# Altium schematic sheet TUSB8041_Connectors_2.SchDoc
size A3; SheetNumber: 1; SheetTotal: 3
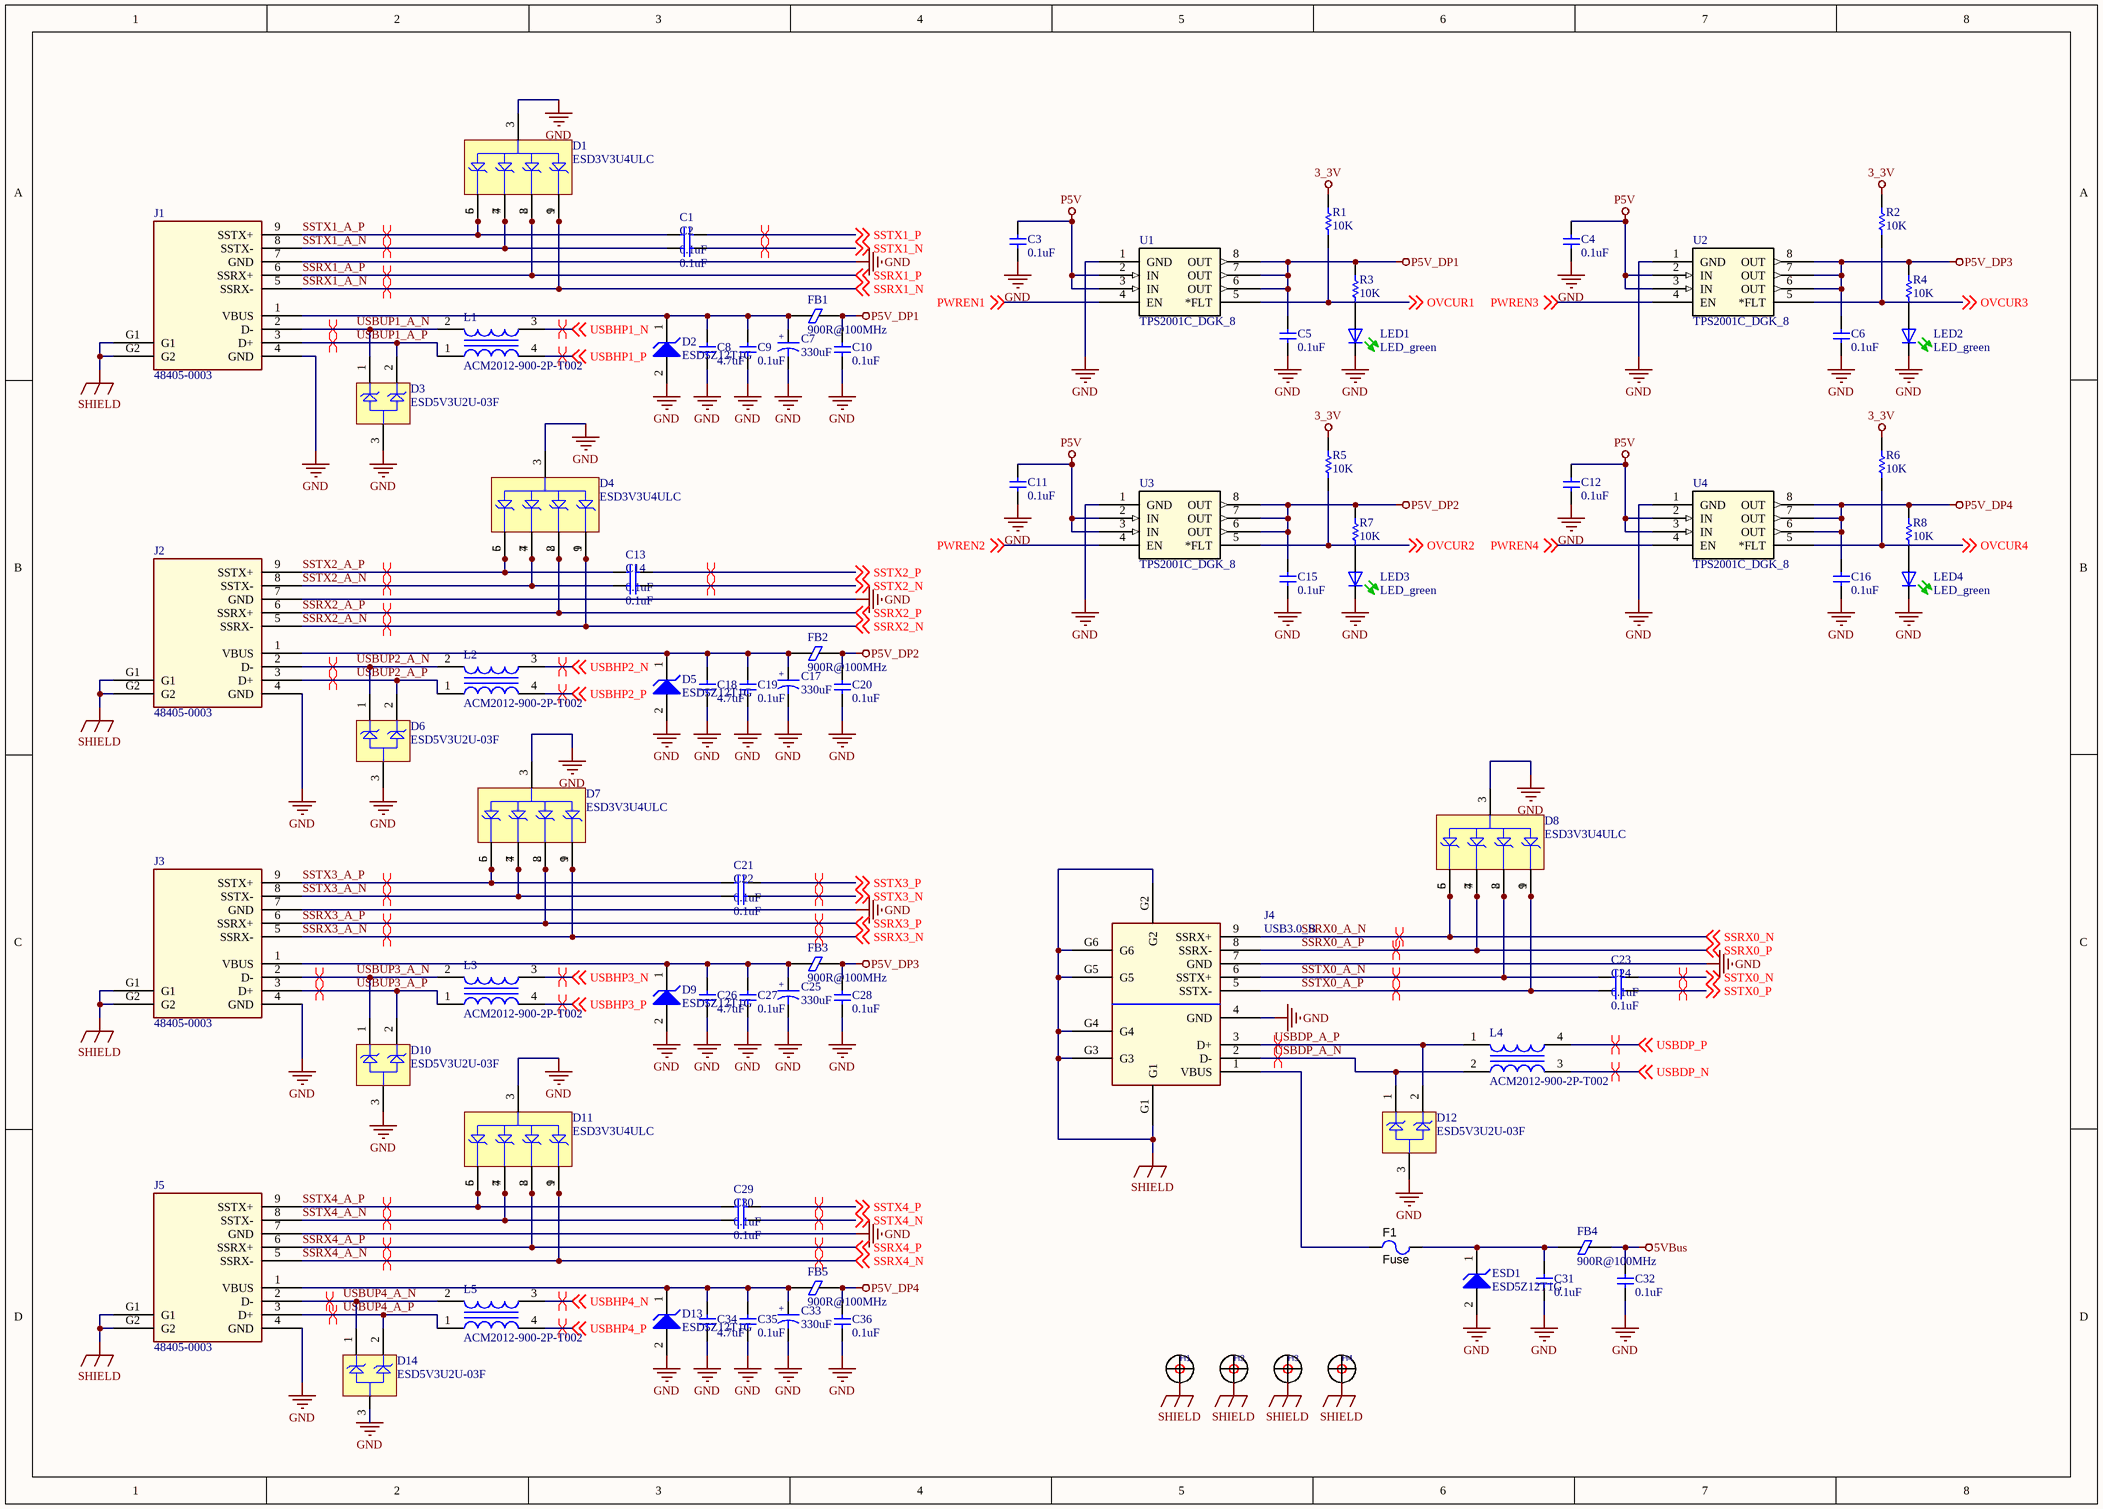
[diagram p0: TUSB8041_Connectors_2.SchDoc]

## Parts
C1  0.1uF  [CAP0402]
C2  0.1uF  [CAP0402]
C3  0.1uF  [CAP0603]
C4  0.1uF  [CAP0603]
C5  0.1uF  [CAP0603]
C6  0.1uF  [CAP0603]
C7  330uF  [CAP7343_TANT]
C8  4.7uF  [CAP0603]
C9  0.1uF  [CAP0603]
C10  0.1uF  [CAP0603]
C11  0.1uF  [CAP0603]
C12  0.1uF  [CAP0603]
C13  0.1uF  [CAP0402]
C14  0.1uF  [CAP0402]
C15  0.1uF  [CAP0603]
C16  0.1uF  [CAP0603]
C17  330uF  [CAP7343_TANT]
C18  4.7uF  [CAP0603]
C19  0.1uF  [CAP0603]
C20  0.1uF  [CAP0603]
C21  0.1uF  [CAP0402]
C22  0.1uF  [CAP0402]
C23  0.1uF  [CAP0402]
C24  0.1uF  [CAP0402]
C25  330uF  [CAP7343_TANT]
C26  4.7uF  [CAP0603]
C27  0.1uF  [CAP0603]
C28  0.1uF  [CAP0603]
C29  0.1uF  [CAP0402]
C30  0.1uF  [CAP0402]
C31  0.1uF  [CAP0603]
C32  0.1uF  [CAP0603]
C33  330uF  [CAP7343_TANT]
C34  4.7uF  [CAP0603]
C35  0.1uF  [CAP0603]
C36  0.1uF  [CAP0603]
D1  ESD3V3U4ULC  [PG-TSLP-9-1]
D2  ESD5Z12T1G  [ONSC-SOD-523-2-502-01_V]
D3  ESD5V3U2U-03F  [INF-PG-TSFP-3-1_V]
D4  ESD3V3U4ULC  [PG-TSLP-9-1]
D5  ESD5Z12T1G  [ONSC-SOD-523-2-502-01_V]
D6  ESD5V3U2U-03F  [INF-PG-TSFP-3-1_V]
D7  ESD3V3U4ULC  [PG-TSLP-9-1]
D8  ESD3V3U4ULC  [PG-TSLP-9-1]
D9  ESD5Z12T1G  [ONSC-SOD-523-2-502-01_V]
D10  ESD5V3U2U-03F  [INF-PG-TSFP-3-1_V]
D11  ESD3V3U4ULC  [PG-TSLP-9-1]
D12  ESD5V3U2U-03F  [INF-PG-TSFP-3-1_V]
D13  ESD5Z12T1G  [ONSC-SOD-523-2-502-01_V]
D14  ESD5V3U2U-03F  [INF-PG-TSFP-3-1_V]
ESD1  ESD5Z12T1G  [ONSC-SOD-523-2-502-01_V]
F1  Fuse  [FUSE1206]
FB1  900R@100MHz  [L0805]
FB2  900R@100MHz  [L0805]
FB3  900R@100MHz  [L0805]
FB4  900R@100MHz  [L0805]
FB5  900R@100MHz  [L0805]
H1  HOLE  [HOLE_Φ3_1_2D]  (value not drawn)
H2  HOLE  [HOLE_Φ3_1_2D]  (value not drawn)
H3  HOLE  [HOLE_Φ3_1_2D]  (value not drawn)
H4  HOLE  [HOLE_Φ3_1_2D]  (value not drawn)
J1  48405-0003  [CN_USB30_A]
J2  48405-0003  [CN_USB30_A]
J3  48405-0003  [CN_USB30_A]
J4  USB3.0_B  [ASS_4224_CO]
J5  48405-0003  [CN_USB30_A]
L1  ACM2012-900-2P-T002  [TDK-ACM2012_V]
L2  ACM2012-900-2P-T002  [TDK-ACM2012_V]
L3  ACM2012-900-2P-T002  [TDK-ACM2012_V]
L4  ACM2012-900-2P-T002  [TDK-ACM2012_V]
L5  ACM2012-900-2P-T002  [TDK-ACM2012_V]
LED1  LED_green  [LED-0603-GREEN]
LED2  LED_green  [LED-0603-GREEN]
LED3  LED_green  [LED-0603-GREEN]
LED4  LED_green  [LED-0603-GREEN]
R1  10K  [RES0603]
R2  10K  [RES0603]
R3  10K  [RES0603]
R4  10K  [RES0603]
R5  10K  [RES0603]
R6  10K  [RES0603]
R7  10K  [RES0603]
R8  10K  [RES0603]
U1  TPS2001C_DGK_8  [VSSOP8]
U2  TPS2001C_DGK_8  [VSSOP8]
U3  TPS2001C_DGK_8  [VSSOP8]
U4  TPS2001C_DGK_8  [VSSOP8]

## Nets
3_3V: R1.1 R2.1 R5.1 R6.1
5VBus: C32.2 FB4.2
GND: C3.1 C4.1 C5.1 C6.1 C7.2 C8.1 C9.1 C10.1 C11.1 C12.1 C15.1 C16.1 C17.2 C18.1 C19.1 C20.1 C25.2 C26.1 C27.1 C28.1 C31.1 C32.1 C33.2 C34.1 C35.1 C36.1 D1.3(A) D2.2(A) D3.3(A) D4.3(A) D5.2(A) D6.3(A) D7.3(A) D8.3(A) D9.2(A) D10.3(A) D11.3(A) D12.3(A) D13.2(A) D14.3(A) ESD1.2(A) J1.4(GND) J1.7(GND) J2.4(GND) J2.7(GND) J3.4(GND) J3.7(GND) J4.4(GND) J4.7(GND) J5.4(GND) J5.7(GND) LED1.K(C) LED2.K(C) LED3.K(C) LED4.K(C) U1.1(GND) U2.1(GND) U3.1(GND) U4.1(GND)
P5V: C3.2 C4.2 C11.2 C12.2 U1.2(IN) U1.3(IN) U2.2(IN) U2.3(IN) U3.2(IN) U3.3(IN) U4.2(IN) U4.3(IN)
P5V_DP1: C5.2 C10.2 FB1.2 R3.1 U1.6(OUT) U1.7(OUT) U1.8(OUT)
P5V_DP2: C15.2 C20.2 FB2.2 R7.1 U3.6(OUT) U3.7(OUT) U3.8(OUT)
P5V_DP3: C6.2 C28.2 FB3.2 R4.1 U2.6(OUT) U2.7(OUT) U2.8(OUT)
P5V_DP4: C16.2 C36.2 FB5.2 R8.1 U4.6(OUT) U4.7(OUT) U4.8(OUT)
SHIELD: H1.1 H2.1 H3.1 H4.1 J1.G1 J1.G2 J2.G1 J2.G2 J3.G1 J3.G2 J4.G1 J4.G2 J4.G3 J4.G4 J4.G5 J4.G6 J5.G1 J5.G2
OVCUR1: R1.2 U1.5(*FLT) ; off-sheet OVCUR1
OVCUR2: R5.2 U3.5(*FLT) ; off-sheet OVCUR2
OVCUR3: R2.2 U2.5(*FLT) ; off-sheet OVCUR3
OVCUR4: R6.2 U4.5(*FLT) ; off-sheet OVCUR4
PWREN1: U1.4(EN) ; off-sheet PWREN1
PWREN2: U3.4(EN) ; off-sheet PWREN2
PWREN3: U2.4(EN) ; off-sheet PWREN3
PWREN4: U4.4(EN) ; off-sheet PWREN4
SSRX0_A_N: D8.5(K5) D8.6(K6) J4.9(SSRX+) ; off-sheet SSRX0_N  [also labelled SSRX0_N]
SSRX0_A_P: D8.4(K4) D8.7(K7) J4.8(SSRX-) ; off-sheet SSRX0_P  [also labelled SSRX0_P]
SSRX1_A_N: D1.1(K1) D1.9(K9) J1.5(SSRX-) ; off-sheet SSRX1_N  [also labelled SSRX1_N]
SSRX1_A_P: D1.2(K2) D1.8(K8) J1.6(SSRX+) ; off-sheet SSRX1_P  [also labelled SSRX1_P]
SSRX2_A_N: D4.1(K1) D4.9(K9) J2.5(SSRX-) ; off-sheet SSRX2_N  [also labelled SSRX2_N]
SSRX2_A_P: D4.2(K2) D4.8(K8) J2.6(SSRX+) ; off-sheet SSRX2_P  [also labelled SSRX2_P]
SSRX3_A_N: D7.1(K1) D7.9(K9) J3.5(SSRX-) ; off-sheet SSRX3_N  [also labelled SSRX3_N]
SSRX3_A_P: D7.2(K2) D7.8(K8) J3.6(SSRX+) ; off-sheet SSRX3_P  [also labelled SSRX3_P]
SSRX4_A_N: D11.1(K1) D11.9(K9) J5.5(SSRX-) ; off-sheet SSRX4_N  [also labelled SSRX4_N]
SSRX4_A_P: D11.2(K2) D11.8(K8) J5.6(SSRX+) ; off-sheet SSRX4_P  [also labelled SSRX4_P]
SSTX0_A_N: C23.2 D8.2(K2) D8.8(K8) J4.6(SSTX+)
SSTX0_A_P: C24.2 D8.1(K1) D8.9(K9) J4.5(SSTX-)
SSTX0_N: C23.1 ; off-sheet SSTX0_N
SSTX0_P: C24.1 ; off-sheet SSTX0_P
SSTX1_A_N: C2.2 D1.4(K4) D1.7(K7) J1.8(SSTX-)
SSTX1_A_P: C1.2 D1.5(K5) D1.6(K6) J1.9(SSTX+)
SSTX1_N: C2.1 ; off-sheet SSTX1_N
SSTX1_P: C1.1 ; off-sheet SSTX1_P
SSTX2_A_N: C14.2 D4.4(K4) D4.7(K7) J2.8(SSTX-)
SSTX2_A_P: C13.2 D4.5(K5) D4.6(K6) J2.9(SSTX+)
SSTX2_N: C14.1 ; off-sheet SSTX2_N
SSTX2_P: C13.1 ; off-sheet SSTX2_P
SSTX3_A_N: C22.2 D7.4(K4) D7.7(K7) J3.8(SSTX-)
SSTX3_A_P: C21.2 D7.5(K5) D7.6(K6) J3.9(SSTX+)
SSTX3_N: C22.1 ; off-sheet SSTX3_N
SSTX3_P: C21.1 ; off-sheet SSTX3_P
SSTX4_A_N: C30.2 D11.4(K4) D11.7(K7) J5.8(SSTX-)
SSTX4_A_P: C29.2 D11.5(K5) D11.6(K6) J5.9(SSTX+)
SSTX4_N: C30.1 ; off-sheet SSTX4_N
SSTX4_P: C29.1 ; off-sheet SSTX4_P
USBDP_A_N: D12.1(K1) J4.2(D-) L4.2
USBDP_A_P: D12.2(K2) J4.3(D+) L4.1
USBDP_N: L4.3 ; off-sheet USBDP_N
USBDP_P: L4.4 ; off-sheet USBDP_P
USBHP1_N: L1.3 ; off-sheet USBHP1_N
USBHP1_P: L1.4 ; off-sheet USBHP1_P
USBHP2_N: L2.3 ; off-sheet USBHP2_N
USBHP2_P: L2.4 ; off-sheet USBHP2_P
USBHP3_N: L3.3 ; off-sheet USBHP3_N
USBHP3_P: L3.4 ; off-sheet USBHP3_P
USBHP4_N: L5.3 ; off-sheet USBHP4_N
USBHP4_P: L5.4 ; off-sheet USBHP4_P
USBUP1_A_N: D3.1(K1) J1.2(D-) L1.2
USBUP1_A_P: D3.2(K2) J1.3(D+) L1.1
USBUP2_A_N: D6.1(K1) J2.2(D-) L2.2
USBUP2_A_P: D6.2(K2) J2.3(D+) L2.1
USBUP3_A_N: D10.1(K1) J3.2(D-) L3.2
USBUP3_A_P: D10.2(K2) J3.3(D+) L3.1
USBUP4_A_N: D14.1(K1) J5.2(D-) L5.2
USBUP4_A_P: D14.2(K2) J5.3(D+) L5.1
NetC7_1: C7.1 C8.2 C9.2 D2.1(K) FB1.1 J1.1(VBUS)
NetC17_1: C17.1 C18.2 C19.2 D5.1(K) FB2.1 J2.1(VBUS)
NetC25_1: C25.1 C26.2 C27.2 D9.1(K) FB3.1 J3.1(VBUS)
NetC31_2: C31.2 ESD1.1(K) F1.1 FB4.1
NetC33_1: C33.1 C34.2 C35.2 D13.1(K) FB5.1 J5.1(VBUS)
NetF1_2: F1.2 J4.1(VBUS)
NetLED1_A: LED1.A R3.2
NetLED2_A: LED2.A R4.2
NetLED3_A: LED3.A R7.2
NetLED4_A: LED4.A R8.2

## Layout directives
differential pair: SSRX0_A_N, SSRX0_A_P, SSRX1_A_N, SSRX1_A_P, SSRX2_A_N, SSRX2_A_P, SSRX3_A_N, SSRX3_A_P, SSRX4_A_N, SSRX4_A_P, SSTX0_A_N, SSTX0_A_P, SSTX0_N, SSTX0_P, SSTX1_A_N, SSTX1_A_P, SSTX1_N, SSTX1_P, SSTX2_A_N, SSTX2_A_P, SSTX2_N, SSTX2_P, SSTX3_A_N, SSTX3_A_P, SSTX3_N, SSTX3_P, SSTX4_A_N, SSTX4_A_P, SSTX4_N, SSTX4_P, USBDP_A_N, USBDP_A_P, USBDP_N, USBDP_P, USBHP1_N, USBHP1_P, USBHP2_N, USBHP2_P, USBHP3_N, USBHP3_P, USBHP4_N, USBHP4_P, USBUP1_A_N, USBUP1_A_P, USBUP2_A_N, USBUP2_A_P, USBUP3_A_N, USBUP3_A_P, USBUP4_A_N, USBUP4_A_P

## Notes on the sheet
- Title
- Size:
- Date:
- A3
- Number:
- Time:
- Revision:
- Sheet
- of
- File:
- (in symbol CAP_POL) +

## Library data of the parts
C1-C6 C8-C16 C18-C24 C26-C32 C34-C36 = CAP: Capacitor; Value: 104; Published: 8-Jun-2000; LatestRevisionDate: 17-Jul-2002; LatestRevisionNote: Re-released for DXP Platform.; PackageReference: RAD-0.3; Publisher: Altium Limited
C7 C17 C25 C33 = CAP_POL
D1 D4 D7 D8 D11 = ESD3V3U4ULC: Ultra-Low Capacitance ESD / Transient Protection Array, -40 to 125 degC, PG-TSLP-9-1, Reel, Green; Manufacturer: Infineon; VRWM (max): 3.3Â V; CL (typ): 0.4Â pF; CL (max): 0.65Â pF; Rdyn typ reverse: 0.19Â Ohm; IEFT: 50 A; IR (max): 50Â uA; Rdyn typ forward: 0.23Â Ohm; Protected Lines: 4; VESD (max): 20Â kV; Green: TRUE; Isurge: 3 A; PackageVersion: Mar-13; ComponentLink2Description: Datasheet; ComponentLink3Description: Package Specification; ComponentLink1Description: Manufacturer URL; DatasheetVersion: Rev. 1.2; Packing: Reel; PackageDescription: 9-Pin Thin Small Leadless Package, Body 2.3 x 1 mm, Pitch 0.5 mm; PackageReference: PG-TSLP-9-1; ComponentLink2URL: http://www.infineon.com/dgdl/ESD3V3U4ULC_rev_1_2_ESD_Transient_Protection_Diode_Infineon.pdf?folderId=db3a30431f848401011fcbf2ab4c04c4&fileId=db3a30433004641301300d2a08107ac6; ComponentLink3URL: http://www.infineon.com/dgdl/ESD3V3U4ULC_rev_1_2_ESD_Transient_Protection_Diode_Infineon.pdf?folderId=db3a30431f848401011fcbf2ab4c04c4&fileId=db3a30433004641301300d2a08107ac6; ComponentLink1URL: http://www.infineon.com/; Halogen-free: TRUE; PartNumber: ESD3V3U4ULC; Mounting Technology: Surface Mount
D2 D5 D9 D13 ESD1 = CMP-1063-00099-1: Transient Voltage Suppressor, Micro-Packaged Diode for ESD Protection, 2-Pin SOD-523, Pb-Free, Tape and Reel; Manufacturer: On Semiconductor; VRWM Max (V): 12; Number of Lines: 1; V(BR) Min (V): 14.1; Direction: Unidirectional; IR Max (uA): 0.01; PPK Max (W): 240; ComponentLink1URL: http://www.onsemi.com/; PartNumber: ESD5Z12T1G; RoHS: Pb-Free; ComponentLink3Description: Package Specification; PackageVersion: Rev. E, 09/2010; PackageReference: SOD-523-2-502-01; PackageDescription: 2-Pin SOD, Body 1.2 x 0.8 mm; ComponentLink2Description: Datasheet; ComponentLink1Description: Manufacturer URL; Mounting Technology: Surface Mount; DatasheetVersion: Rev. 10; ComponentLink3URL: http://www.onsemi.com/pub_link/Collateral/502-01.PDF; ComponentLink2URL: http://www.onsemi.cn/pub_link/Collateral/ESD5Z2.5T1-D.PDF; Packing: Tape and Reel
D3 D6 D10 D12 D14 = CMP-1150-00002-1: Ultra-Low Capacitance ESD Diode Array, -40 to 125 degC, PG-TSFP-3-1, Reel, Green; Manufacturer: Infineon; Rdyn typ reverse: 0.6Â Ohm; Rdyn typ forward: 0.5Â Ohm; VRWM (max): 5.3Â V; IR (max): 50Â uA; CL (typ): 0.4Â pF; IEFT: 40 A; VESD (max): 20Â kV; Isurge: 3 A; CL (max): 0.6Â pF; Green: TRUE; Protected Lines: 2; ComponentLink3URL: http://www.infineon.com/dgdl/TSFP-3-1%2C-2-Package_Overview.pdf?folderId=db3a30431936bc4b0119538cdcb03d2d&fileId=db3a30431936bc4b0119539929863d46; PartNumber: ESD5V3U2U-03F; ComponentLink3Description: Package Specification; ComponentLink2Description: Datasheet; ComponentLink2URL: http://www.infineon.com/dgdl/esd5v3u2useries.pdf?folderId=db3a30431441fb5d011488a9e66f0ded&fileId=db3a30431b0626df011b0d3e3ca97dc0; PackageReference: PG-TSFP-3-1; ComponentLink1URL: http://www.infineon.com/; Mounting Technology: Surface Mount; ComponentLink1Description: Manufacturer URL; PackageVersion: Apr-08; Halogen-free: TRUE; Packing: Reel; PackageDescription: 3-Pin Thin Small Flat Package, Body 1.2 x 0.8 mm, Pitch 0.4 mm
F1 = Fuse: PartNumber: NANOSMDC020F-2; Manufacturer: TE Connectivity; VDC_V: 24; Rtyp_Ohm: 1.875; SymbolCreator: a0412235; SymbolVersion: 2013-04-02; PackageReference: 1206; MountType: SMT; CompType: Fuse; RoHS: Y; Published: 2009-03-05; Publisher: Texas Instruments; LatestRevisionDate: 2015-11-23; ComponentLink1Description: Datasheet URL; ComponentLink1URL: http://www.te.com/commerce/DocumentDelivery/DDEController?Action=srchrtrv&DocNm=SCD25536&DocType=Customer+Drawing&DocLang=English; Supplier 1: Digi-Key; Supplier Part Number 1: NANOSMDC020F-2CT-ND; Supplier 2: Mouser; Supplier Part Number 2: 650-NANOSMDC020F-2; Supplier 3: Farnell; Supplier Part Number 3: 1345939
FB1-FB5 = Ferrite Bead
H1-H4 = HOLE: CLASS: IC; CAD_APPROVED: Yes; MFG_PN01: TP-105-01-09; MFG_NAME01: COMPONENTS CORPORATION; AGILE_PN: 210-75685; HEIGHT: 4.8 MM; ROHS: Yes
J1-J3 J5 = USB-UEA11123-4HK1-4H: Date: 02042009
L1-L5 = CMP-2000-05738-1: Common Mode Filter, 90 Ohm, 50 V, -40 to 85 degC, 4-Pin SMD, RoHS, Tape and Reel; Manufacturer: TDKCorporation; Test Frequency: 100MHz; Configuration: Dual; Maximum DC Resistance: 190mOhm; Product Depth: 1.4mm; Product Height: 1.3mm; Voltage Rating: 50VDC; Impedance: 90Ohm; Product Length: 2.2mm; Number of Lines: 2; Maximum DC Current: 400mA; Type: SignalLine; Maximum Operating Temperature: 85C; Minimum Operating Temperature: -40C; Part No: ACM2012-900-2P-T; Datasheet Version: 12/2015; Family: ACM; RoHS: Yes; Inductance: N/A; Manufacturer URL: http://www.tdk.com/; Mounting Technology: SurfaceMount; Package Description: 4-Pin Surface Mounted Device, Body 2 x 1.2 mm, Pitch 0.8 mm; Attenuation: N/A; Package Reference: ACM2012; Packaging: TapeandReel; Minimum Insulation Resistance: N/A; Withstand Voltage: N/A; Leakage Inductance: N/A; Datasheet URL: https://product.tdk.com/info/en/catalog/datasheets/cmf_commercial_signal_acm2012_en.pdf
R1-R8 = RES: Resistor; Value: 1K; Published: 8-Jun-2000; Revision: July-2002: Re-released for DXP Platform.; Publisher: Altium Limited
U1-U4 = TPS2001C_DGK_8: 2A_MOS_PSW; Vendor: Texas Instruments; PACKAGE_DESIGNATOR: DGK; PIN_COUNT: 8; FAMILY_NAME: USB POWER SWITCH; INDUSTRY_STD_PKG_TYPE: MSOP; Manufacturer_Part_Number: tps2001c_dgk_8; GENERIC_PART_NUMBER: TPS2001C; Datasheet URL: http://www.ti.com/lit/gpn/TPS2001C; Manufacturer: Texas Instruments; RefDes: RefDes; Type: Type; Value: Value
J4 = USB3.0_B: Date: 02042009